# EAGLE design usb_power_hub (EAGLE 9.0.0)
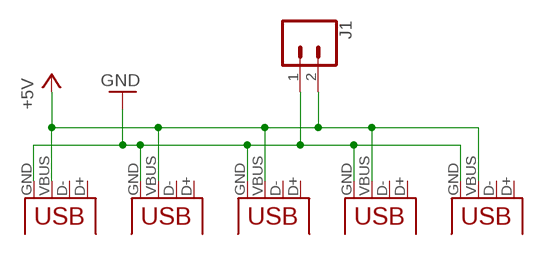
[diagram p0: schematic, sheet 1]

## Parts
J1  CONN_025MM  [SCREWTERMINAL-5MM-2]
X1  USB-A-H  [USB-A-H]
X2  USB-A-H  [USB-A-H]
X3  USB-A-H  [USB-A-H]
X4  USB-A-H  [USB-A-H]
X5  USB-A-H  [USB-A-H]

## Nets
+5V: J1.2 X1.VBUS X2.VBUS X3.VBUS X4.VBUS X5.VBUS
GND: J1.1 X1.GND X2.GND X3.GND X4.GND X5.GND
Unconnected: X1.D+ X1.D- X2.D+ X2.D- X3.D+ X3.D- X4.D+ X4.D- X5.D+ X5.D-

## Library data of the parts
J1 = SparkFun-Connectors:CONN_02: Multi connection point. Often used as Generic Header-pin footprint for 0.1 inch spaced/style header connections On any of the 0.1 inch spaced packages, you can populate with these: Break Away Headers - Straight <https://www.sparkfun.com/products/116> (PRT-00116) Break Away Male Headers - Right Angle <https://www.sparkfun.com/products/553> (PRT-00553) Female Headers <https://www.sparkfun.com/products/115> (PRT-00115) Break Away Headers - Machine Pin <https://www.sparkfun.com/products/117> (PRT-00117) Break Away Female Headers - Swiss Machine Pin <https://www.sparkfun.com/products/743> (PRT-00743) For SCREWTERMINALS and SPRING TERMINALS visit here: Screw Terimnals on SparkFun.com <https://www.sparkfun.com/search/results?term=Screw+Terminals> (5mm/3.5mm/2.54mm spacing) This device is also useful as a general connection point to wire up your design to another part of your project. Our various solder wires solder well into these plated through hole pads. Hook-Up Wire - Assortment (Stranded, 22 AWG) <https://www.sparkfun.com/products/11375> (PRT-11375) Hook-Up Wire - Assortment (Solid Core, 22 AWG) <https://www.sparkfun.com/products/11367> (PRT-11367) View the entire wire category on our website here <https://www.sparkfun.com/categories/141> Special notes: Molex polarized connector foot print use with: PRT-08233 with associated crimp pins and housings. 2.54_SCREWTERM for use with PRT-10571. 3.5mm Screw Terminal footprints for PRT-08084 5mm Screw Terminal footprints for use with PRT-08432; SF_SKU: PRT-08432
X1-X5 = con-usb:USB: USB Connectors

## Board
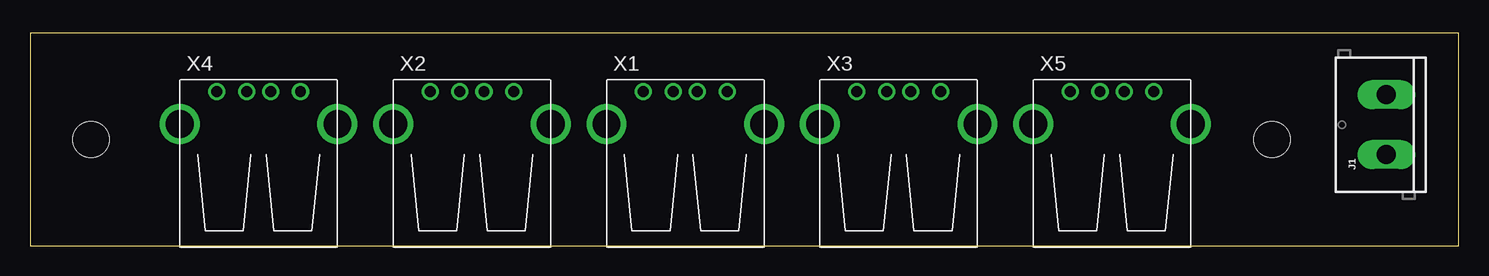
[diagram p1: board, top side]
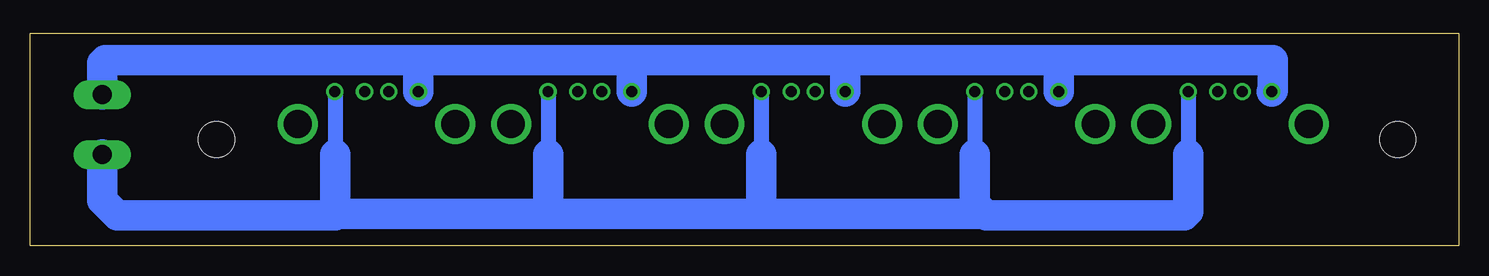
[diagram p2: board, bottom side, seen from below]

Size 119.05 x 17.77 mm. Coordinates in mm from the lower left corner, seen from the top.
Outline: 0,0 119.05,0 119.05,17.77 0,17.77 0,0
Copper layers (1*16): Top 0.035mm / dielectric 1.5mm / Bottom 0.035mm
Design rules "default": minimum track width 6mil, minimum drill 0.35mm, track to track 6mil, track to pad 6mil, pad to pad 6mil, via to via 6mil, smd to smd 6mil, copper to edge 40mil, drill to drill 6mil, minimum pad ring 10mil, minimum via ring 8mil, stop-mask expansion 4mil, vias tented up to drill 0mil, thermal gap 10mil
Holes 3 mm at 5.08,8.89 103.5,8.89

### Footprints (pad centres in the part's own frame; a part is rotated, then mirrored left to right if it is on the bottom)
SCREWTERMINAL-5MM-2 = drill 1.6 pad 2.032 long: 1 0,0; 2 5,0
USB-A-H = drill 0.914: D+ 2.718,-1.003; D- 2.718,1.003; GND 2.718,-3.493; VBUS 2.718,3.493 | drill 2.311: P$5 0,-6.566; P$6 0,6.566

### Placement (x,y rotation side)
J1  113.03,7.62 90 top
X1  54.61,10.16 90 top
X2  36.83,10.16 90 top
X3  72.39,10.16 90 top
X4  19.05,10.16 90 top
X5  90.17,10.16 90 top

### Tracks (layer width: path | path; a pad name or v marks a point on that pad's centre or on a via)
+5V
  Bottom 2.54: X3.VBUS 68.9,15.42 68.83,15.48 | 86.36,15.48 68.83,15.48 | X5.VBUS 86.68,15.17 86.36,15.48 | X1.VBUS 51.12,15.42 51.18,15.48 | 51.18,15.48 68.83,15.48 | X2.VBUS 33.34,15.3 | 51.18,15.48 33.52,15.48 33.34,15.3 | 33.34,15.3 33.16,15.48 15.49,15.48 15.49,12.94 X4.VBUS | J1.2 113.03,15.24 112.79,15.48 86.36,15.48
GND
  Bottom 1.27: 58.04,2.67 74.93,2.67 | 74.93,2.67 76.07,2.67 75.88,2.86 | 93.73,2.92 93.53,2.6 74.99,2.6 74.93,2.67 | 93.73,12.81 X5.GND 93.6,12.81 93.6,7.62 93.6,2.54 | X4.GND 22.54,7.62 | X2.GND 40.32,7.62 | X1.GND 58.1,7.62 | X3.GND 75.88,7.62
  Bottom 2.54: 22.54,7.62 22.54,2.86 22.86,2.54 39.37,2.54 39.5,2.67 | 40.32,7.62 40.32,3.49 39.5,2.67 | 58.04,2.67 39.5,2.67 | 58.04,2.67 93.47,2.67 93.53,2.6 | 75.88,7.62 75.88,2.86 | 93.53,2.6 93.6,2.54 111.76,2.54 113.03,3.81 J1.1 | 58.1,7.62 58.1,2.73 58.04,2.67 | 93.6,7.62 93.6,2.67 93.53,2.6